# Altium schematic sheet sch_audio.SchDoc
size B; SheetNumber: 2; SheetTotal: 7
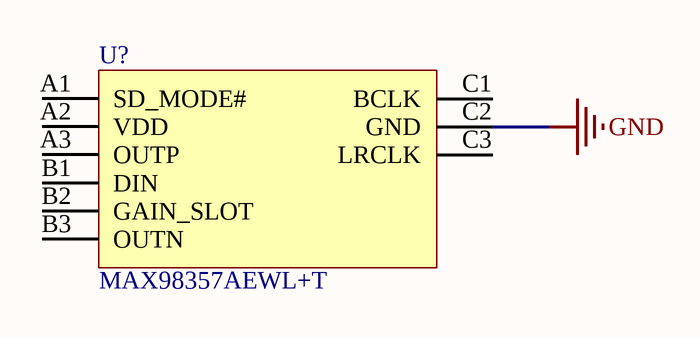
[diagram p0: sch_audio.SchDoc]

## Parts
U?  MAX98357AEWL+T  [WLP-9_L1.4-W1.3-P0.40-R3-C3-BR]

## Nets
GND: U?.C2(GND)

Not connected (* = marked no-connect by the designer): U? A1(SD_MODE#) A2(VDD) A3(OUTP) B1(DIN) B2(GAIN_SLOT) B3(OUTN) C1(BCLK) C3(LRCLK)

## Library data of the parts
U? = MAX98357AEWL+T: JLC: C2682619; MFAC: MAX98357AEWL+T